# Altium schematic sheet USB.SchDoc
size A4; SheetNumber: 4; SheetTotal: 4
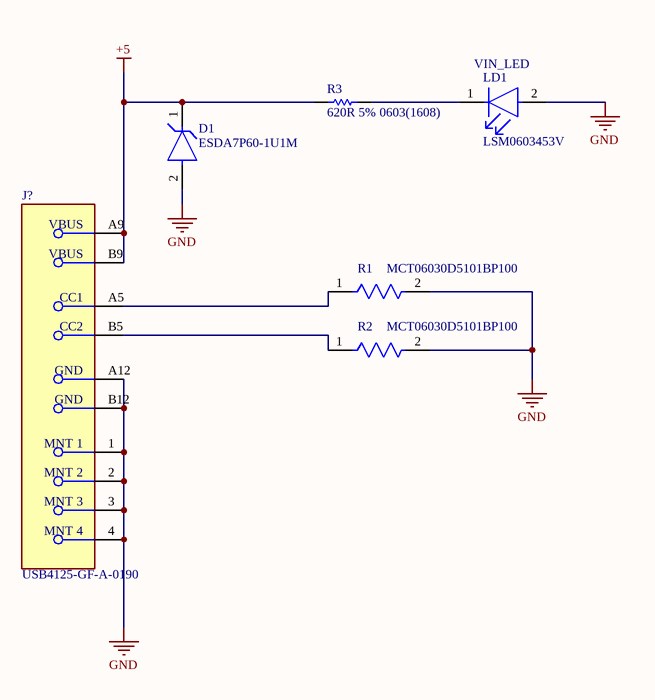
[diagram p0: USB.SchDoc]

## Parts
D1  ESDA7P60-1U1M  [FP-1610-MFG]
J?  USB4125-GF-A-0190  [FP-USB4125-GF-A-0190-MFG]
LD1  LSM0603453V  [FP-LSM0603453V-MFG]
R1  MCT06030D5101BP100  [FP-MCT0603-IPC_B]
R2  MCT06030D5101BP100  [FP-MCT0603-IPC_B]
R3  620R 5% 0603(1608)  [RESC0603(1608)_M]

## Nets
+5: D1.1(C) J?.A9(VBUS) J?.B9(VBUS) R3.1
GND: D1.2(A) J?.1(MNT_1) J?.2(MNT_2) J?.3(MNT_3) J?.4(MNT_4) J?.A12(GND) J?.B12(GND) LD1.2(A) R1.2 R2.2
NetJ?_A5: J?.A5(CC1) R1.1
NetJ?_B5: J?.B5(CC2) R2.1
NetLD1_1: LD1.1(C) R3.2

## Notes on the sheet
- (near LD1) VIN_LED

## Library data of the parts
D1 = CMP-12225-000013-1: TVS DIODE 5V 11.6V 1610; Manufacturer: STMicroelectronics; Number Of Channels: 1; Standoff Height: 0mm; Breakdown Voltage: 6.4V; Direction: Unidirectional; Clamping Voltage: 10.2V; Peak Pulse Power: 700W; Peak Pulse Current: 60A; Description: 11.6V Clamp 60A (8/20µs) Ipp Tvs Diode Surface Mount 1610; Max Junction Temp: +150°C; ComponentLink2Description: Datasheet; Temperature Range Low: -55°C; Package: 1610; Lead Free: Yes; Temperature Range High: +150°C; Temperature: -55°C to +150°C; Device Class L2: TVS Diodes; Category: Diode; Device Class L1: Circuit Protection; Manufacturer Part Number: ESDA7P60-1U1M; Digikey Description: TVS DIODE 5V 11.6V 1610; ComponentLink2URL: http://www.st.com/content/ccc/resource/technical/document/datasheet/44/e9/26/44/42/ee/4f/e5/DM00139972.pdf/files/DM00139972.pdf/jcr:content/translations/en.DM00139972.pdf; Reverse Standoff Voltage: 5V; RoHS: TRUE; Octopart: https://octopart.com/esda7p60-1u1m-stmicroelectronics-52112702; Height: 0.65mm; Device Class L3: unset; Automotive: No
J? = CMP-245163-000004-1: CONN RCPT TYPE C 6P SMD RA
LD1 = CMP-00731-94024739-1: LSM0603453V LED SM 0603 3V -/1000/-mcd Green; Forward Current: 20mA; Forward Voltage: 2.3V; Viewing Angle: 120°; Reverse Voltage: 5V; Power Dissipation: 60mW; Wavelength: 576nm; Luminous Intensity: 120mcd; NexarPartId: 94024739; Height: 550µm; Max Operating Temperature: 85°C; Schedule B: 8541402000, 8541406050; Case/Package: 0603; Color: Green; Min Operating Temperature: -40°C
R1 R2 = CMP-02407-000449-1: RES SMD 100 OHM 1% 1/8W 0603; Resistance: 5.1kR; Min Operating Temperature: -55°C; Lead Free: Lead Free; Military Standard: Not; Max Operating Temperature: 125°C; Length: 1.55mm; Width: 850um; Case/Package: 0603; Composition: Thin Film; Packaging: Tape and Reel; Depth: 0.85mm
R3 = CMP-1012-00069-1: 620R 0.1W 5% 0603 (1608 Metric)  SMD; Case-Metric: 1608; Value: 620.00 Ohm; Case-EIA: 0603; Tolerance: 5 %; Technology: SMT; Power: 0.1 W